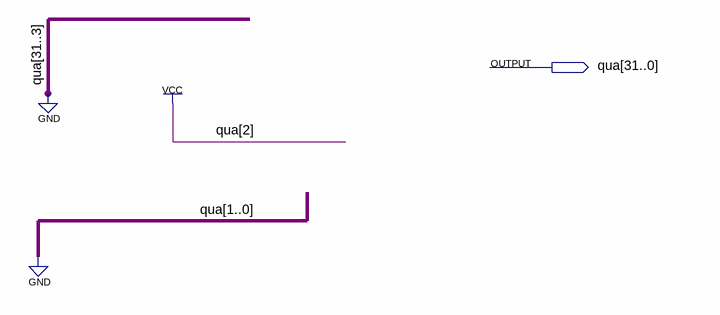
[diagram p0: schematic sheet]
// Quartus schematic Mais4.bdf as structural Verilog: 0 symbols, 1 pins
module Mais4 (
  output [31:0] qua
);


  assign qua = 32'b00000000000000000000000000000100;
endmodule
